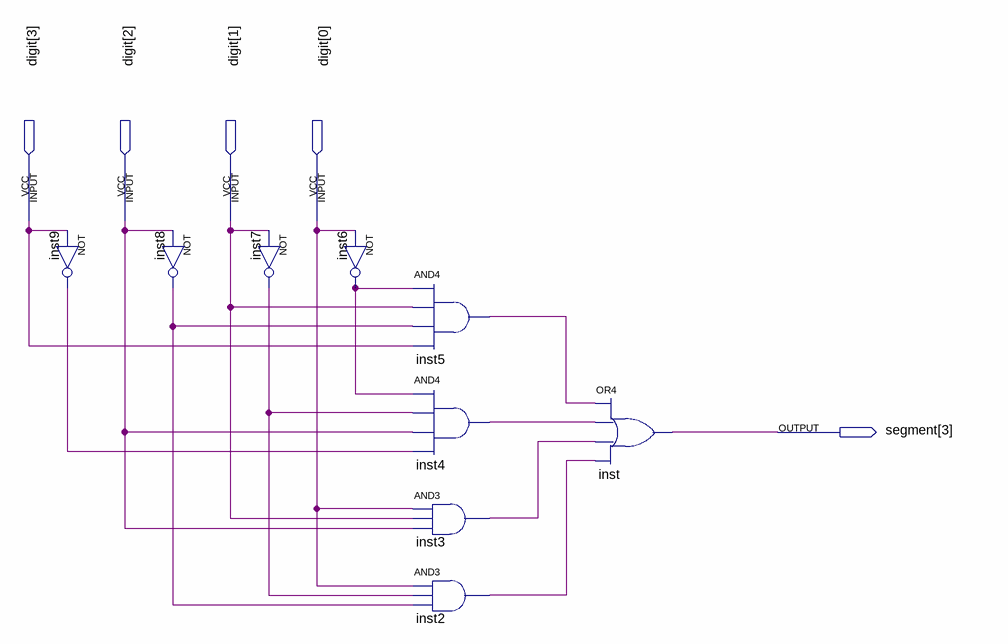
[diagram p0: schematic sheet]
// Quartus schematic segmentD.bdf as structural Verilog: 9 symbols, 5 pins
module segmentD (
  input  [3:0] digit,
  output [3:3] segment
);

  wire inst2_out, inst3_out, inst4_out, inst5_out, inst6_out, inst7_out, inst8_out, inst9_out;

  not inst9 (inst9_out, digit[3]);
  not inst8 (inst8_out, digit[2]);
  not inst7 (inst7_out, digit[1]);
  not inst6 (inst6_out, digit[0]);
  and inst5 (inst5_out, inst6_out, digit[1], inst8_out, digit[3]);
  and inst4 (inst4_out, inst6_out, inst7_out, digit[2], inst9_out);
  and inst3 (inst3_out, digit[0], digit[1], digit[2]);
  and inst2 (inst2_out, digit[0], inst7_out, inst8_out);
  or inst (segment[3], inst5_out, inst4_out, inst3_out, inst2_out);
endmodule
